# Altium schematic sheet Sheet1.SchDoc
size A; SheetNumber: 1; SheetTotal: 1
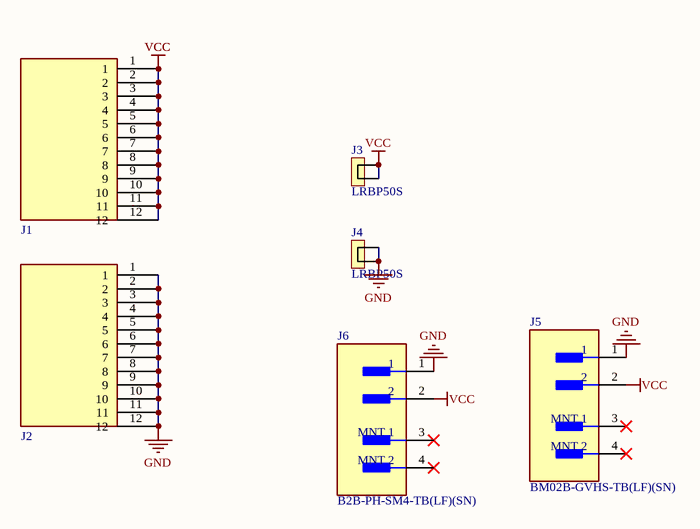
[diagram p0: Sheet1.SchDoc]

## Parts
J1  A01F-H1-A Female  [A01F-H1-A]  (value not drawn)
J2  A01F-H1-A Female  [A01F-H1-A]  (value not drawn)
J3  LRBP50S  [LRBP50S]
J4  LRBP50S  [LRBP50S]
J5  BM02B-GVHS-TB(LF)(SN)  [FP-BM02B-GVHS-TB_LF_SN-MFG]
J6  B2B-PH-SM4-TB(LF)(SN)  [FP-B2B-PH-SM4-TB_LF_SN-MFG]

## Nets
GND: J2.1 J2.2 J2.3 J2.4 J2.5 J2.6 J2.7 J2.8 J2.9 J2.10 J2.11 J2.12 J4.1 J4.2 J5.1 J6.1
VCC: J1.1 J1.2 J1.3 J1.4 J1.5 J1.6 J1.7 J1.8 J1.9 J1.10 J1.11 J1.12 J3.1 J3.2 J5.2 J6.2

Not connected (* = marked no-connect by the designer): J5 3(MNT_1)* 4(MNT_2)*; J6 3(MNT_1)* 4(MNT_2)*

## Library data of the parts
J1 J2 = A01F-H1-A: ComponentLink1Description: New link; ComponentLink1URL: https://www.aliexpress.us/item/3256806678504944.html?spm=a2g0o.detail.pcDetailBottomMoreOtherSeller.2.357aedyPedyPyt&gps-id=pcDetailBottomMoreOtherSeller&scm=1007.40050.354490.0&scm_id=1007.40050.354490.0&scm-url=1007.40050.354490.0&pvid=a768a161-9901-4811-b101-05a15b7a8653&_t=gps-id:pcDetailBottomMoreOtherSeller,scm-url:1007.40050.354490.0,pvid:a768a161-9901-4811-b101-05a15b7a8653,tpp_buckets:668%232846%238110%231995&isseo=y&pdp_npi=4%40dis%21USD%211.52%210.99%21%21%211.52%210.99%21%402103244617225425575533636e8077%2112000038560097796%21rec%21US%21%21ABX&utparam-url=scene%3ApcDetailBottomMoreOtherSeller%7Cquery_from%3A
J5 = CMP-17439-000342-1: CONN HEADER SMD 2POS 1.25MM; Voltage Rating: 50V; Number of Positions: 2; Pitch: 0.049inch; Mated Stacking Heights: 8.8mm; Min Operating Temperature: -25°C; Number of Rows: 1; Packaging: Cut Tape; Connector Type: Header; Contact Shape: Rectangular; Insulation Color: Natural; Color: Natural; Series: GVH; Flammability Rating: UL94 V-0; Contact Type: Outer Shroud Contact; Mount: Surface Mount; Max Operating Temperature: 85°C; Contact Finish - Mating: TIN; Fastening Type: Latch; Termination: Solder; Insulation Material: Nylon; Contact Plating: Tin; Contact Material: Bronze
J6 = CMP-2000-05163-2: CONN HEADER SMD 2POS 2MM; Number of Poles: 2; Max Current Rating: 2A; Gender: Male; Working Voltage: 100V; Mated Stacking Heights: 8.6mm; Contact Resistance: 20mR; Insulation Resistance: 1GR; Number of Contacts: 2; Housing Material: Polyamide; Lead Pitch: 2mm; Packaging: Tape and Reel; Fastening Type: Detent; Contact Finish - Mating: TIN; Width: 5.5mm; Min Operating Temperature: -25°C; Mount: Surface Mount; Current Rating: 2A; Pitch: 2mm; REACH SVHC: No SVHC; Flammability Rating: UL94 V-0; Contact Plating: Tin; Voltage Rating (AC): 100V; Length: 7.95mm; Number of Rows: 1; Max Operating Temperature: 85°C; Connector Type: Header; Height: 9.4mm; Insulation Material: Nylon; Depth: 5mm; Color: White; Termination: Solder; Housing Color: Beige; Contact Mating Length: 0.13inch; Contact Material: Copper Alloy; Orientation: Straight; Contact Type: Male Pin; Lead Free: Lead Free; Voltage Rating: 100V; Series: PH; Number of Positions: 2; Contact Shape: Square; Max Voltage Rating (AC): 100V; Insulation Color: Natural